# EAGLE design Matchstick 2.0 (EAGLE 9.6.2)
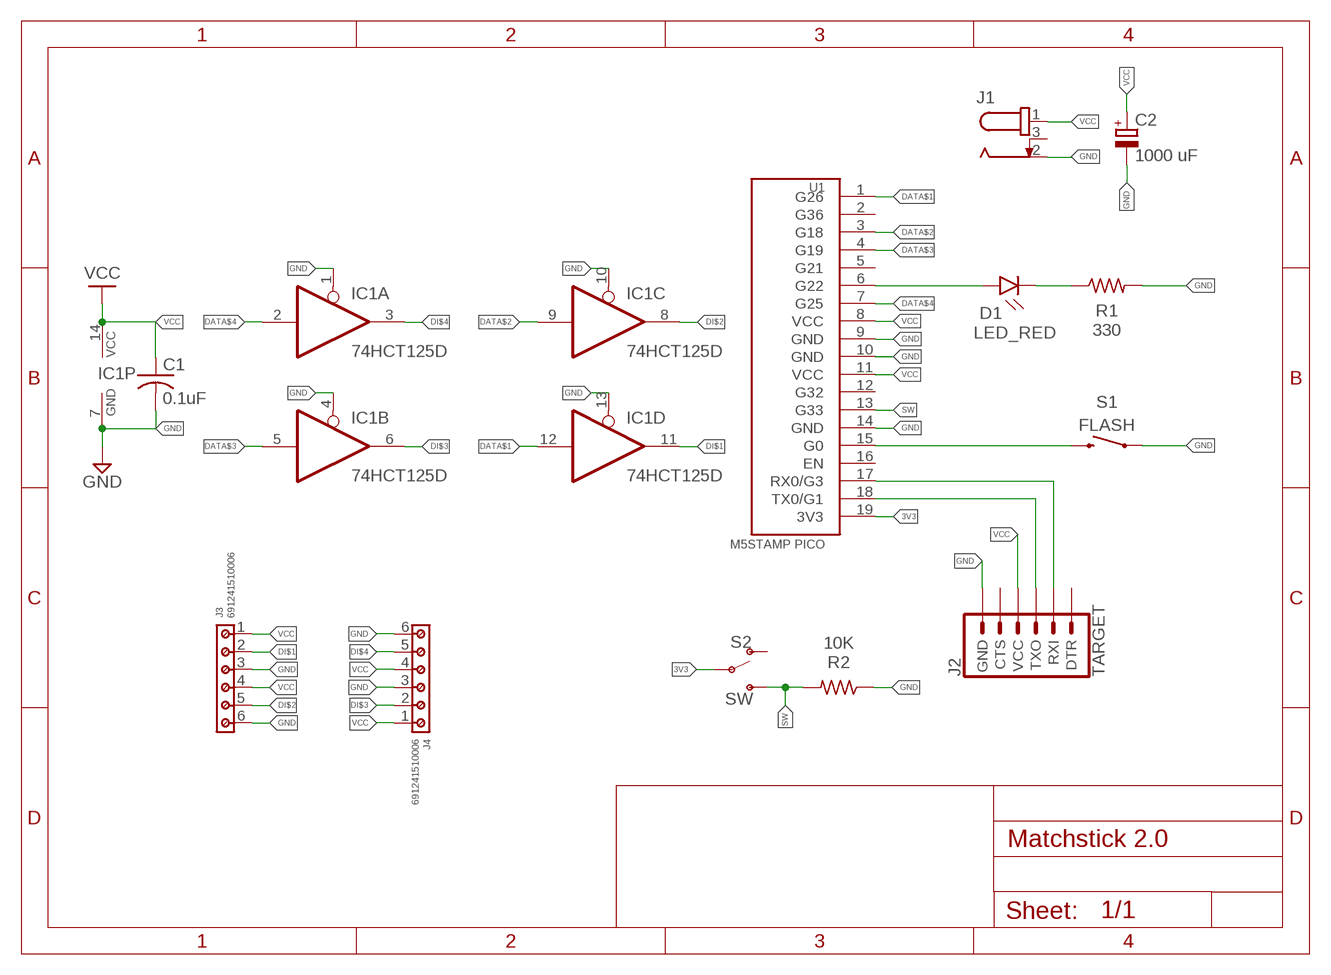
[diagram p0: schematic, sheet 1]

## Parts
C1  0.1uF  C-US_CHIP-0805(2012-METRIC)  [CAPC2012X110]
C2  1000 uF  C-POL_RADIAL-11MM-DIA  [CAPPRD508W65D1000H1100B]
D1  LED_RED  CHIP-FLAT-R_0805  [LEDC2012X110N_FLAT-R]
IC1  74HCT125D  [SO14]
J1  694106301002  [694106301002]
J2  TARGET  6_PIN_SERIAL_TARGETSILK  [6_PIN_SERIAL_TARGET_SIDE_W_SILK]
J3  691241510006  [691241510006]
J4  691241510006  [691241510006]
R1  330  R-US_CHIP-0805(2012-METRIC)  [RESC2012X65]
R2  10K  R-US_CHIP-0805(2012-METRIC)  [RESC2012X65]
S1  FLASH  MOMENTARY-SWITCH-SPST-SMD-5.2MM  [TACTILE_SWITCH_SMD_5.2MM]
S2  SW  SWITCH-SPDT-SMD-RIGHT-ANGLE  [SWITCH_SPST_SMD_A]
U1  M5STAMP PICO  M5STAMP-PICO  [M5STAMP-PICO]

## Nets
3V3: S2.2(P) U1.19(3V3)
DATA$1: IC1.12(D:I) U1.1(G26)
DATA$2: IC1.9(C:I) U1.3(G18)
DATA$3: IC1.5(B:I) U1.4(G19)
DATA$4: IC1.2(A:I) U1.7(G25)
DI$1: IC1.11(D:O) J3.2
DI$2: IC1.8(C:O) J3.5
DI$3: IC1.6(B:O) J4.2
DI$4: IC1.3(A:O) J4.5
G0: S1.3 U1.15(G0)
GND: C1.2 C2.2(-) IC1.1(A:OE) IC1.4(B:OE) IC1.7(P:GND) IC1.10(C:OE) IC1.13(D:OE) J1.2 J2.P$6(GND) J3.3 J3.6 J4.3 J4.6 R1.2 R2.1 S1.1 U1.9(GND) U1.10(GND) U1.14(GND)
RX: J2.P$3(RXI) U1.17(RX0/G3)
SATUS_LED$1: D1.A U1.6(G22)
SATUS_LED$2: D1.C R1.1
SW: R2.2 S2.3(S) U1.13(G33)
TX: J2.P$2(TXO) U1.18(TX0/G1)
VCC: C1.1 C2.1(+) IC1.14(P:VCC) J1.1 J2.P$4(VCC) J3.1 J3.4 J4.1 J4.4 U1.8(VCC) U1.11(VCC)
Unconnected: J1.3 J2.P$1(DTR) J2.P$5(CTS) S2.1(O) U1.2(G36) U1.5(G21) U1.12(G32) U1.16(EN)

## Library data of the parts
C1 = Capacitor:C-US: Capacitor - ANSI; CATEGORY: Capacitor
C2 = Capacitor:C-POL: Capacitor Polarised - Generic; CATEGORY: Capacitor
D1 = LED:CHIP-FLAT-R; CATEGORY: LED; COLOR: RED; DESCRIPTION: CHIP LED FLAT; SUB-CATEGORY: CHIP; TYPE: FLAT_TOP
IC1 = 74xx-eu:74*125: Quad bus BUFFER, 3-state
J1 = DC Power Jacks:694106301002: CONN PWR JACK 2.1X5.5MM SOLDER Manufacturer's datasheet <https://katalog.we-online.de/em/datasheet/6941xx301002.pdf>; CREATED_BY: PCBLayout.com; DIGIKEY_PART_NUMBER: 732-5930-ND; MANUFACTURER: Wurth Electronics Inc.; MPN: 694106301002
J2 = custom:6_PIN_SERIAL_TARGET: 6-pin header connection for use with the "FTDI BASIC" pinout - TARGET SIDE. Also known as "Arduino Serial Program Header". It is used to mate with our FTDI Basic serial programmers using the Arduino IDE. Note, this device has "TARGET" in the name. It is intended to be used on a design that contains a target micro-controller that you wish to program. The "sister" device, named "CABLE" is inteneded to be used on a design that usually lives on the end of your USB cable and prvides the converter chip (FTDI232 or FTDI231x) to commnicate serial RX/TX. You can populate with some of these: Break Away Headers - Straight <https://www.sparkfun.com/products/116> (PRT-00116) For reference (or to suit your programming needs) check out these designs: SparkFun FTDI Basic Breakout - 5V <https://www.sparkfun.com/products/9716> (DEV-09716) SparkFun FTDI Basic Breakout - 3.3V <https://www.sparkfun.com/products/9873> (DEV-09873) SparkFun FTDI SmartBasic <https://www.sparkfun.com/products/12935> (DEV-12935) SparkFun Beefy 3 - FTDI Basic Breakout <https://www.sparkfun.com/products/13746> (DEV-13746)
J3 J4 = Wurth_Connectors_WR-TBL Rising Cage Clamp:691241510006: WR-TBL Serie 2415 - 5.08 mm Horizontal Entry Modular w. Rising Cage Clamp KIND PROPERTIES Pitch 5.08 mm MATERIAL PROPERTIES Insulator Material PA66 Insulator Flammability Rating UL94 V-0 Terminal Screw Material Steel Terminal Screw Plating Zinc Wire Guard Material Copper Alloy GENERAL INFORMATION Operating Temperature -30 up to +120 °C Compliance ROHS & Reach ELECTRICAL PROPERTIES IR UL 14 A IR VDE 24 A Working Voltage [UL] 300 V (AC) Working Voltage [VDE] 250 V (AC) Withstanding Voltage [UL] 1600 V (AC) Withstanding Voltage [VDE] 2000 V (AC) Contact Resistance 20 mΩ MECHANICAL PROPERTIES Wire Strip Length 6 Screw M3 CERTIFICATION UL Approval E150931 VDE Approval 40021365 PACKAGING PROPERTIES Packaging Box <https://www.we-online.com/catalog/media/o79416v209%20Family_WR-TBL_6912427000xx_6912425000xx.jpg> Details see: https://www.we-online.com/catalog/en/TBL_5_08_2415_HORIZONTAL_ENTRY_W_RISING_CAGE_6912415100xx/ Updated by Ella Wu 2019-11-26 2019(C) Wurth Elektronik; IR-UL: 14A; IR-VDE: 14A; PART-NUMBER: 691241510006; PINS: 6; PITCH: 5.08mm; TYPE: Horizontal; WIRE: 14 to 30 (AWG) 2.08 to 0.0509 (mm²); WORKING-VOLTAGE-UL: 300V (AC); WORKING-VOLTAGE-VDE: 250V (AC)
R1 R2 = Resistor:R-US: Resistor Fixed - ANSI; CATEGORY: Resistor; SUB-CATEGORY: Fixed
S1 = SparkFun-Switches:MOMENTARY-SWITCH-SPST: Momentary Switch (Pushbutton) - SPST Normally-open (NO) SPST momentary switches (buttons, pushbuttons). Variants PTH-12MM - 12mm square, through-hole Momentary Pushbutton Switch - 12mm Square <https://www.sparkfun.com/products/9190> (COM-09190) PTH-6.0MM, PTH-6.0MM-KIT - 6.0mm square, through-hole Mini Pushbutton Switch <https://www.sparkfun.com/products/97> (COM-00097) KIT package intended for soldering kit's - only one side of pads' copper is exposed. PTH-RIGHT-ANGLE-KIT - Right-angle, through-hole Right Angle Tactile Button <https://www.sparkfun.com/products/10791> - Used on SparkFun BigTime Watch Kit <https://www.sparkfun.com/products/11734> SMD-12MM - 12mm square, surface-mount Tactile Button - SMD (12mm) <https://www.sparkfun.com/products/12993> (COM-12993) Used on SparkFun PicoBoard <https://www.sparkfun.com/products/11888> SMD-4.5MM - 4.5mm Square Trackball Switch Used on SparkFun Blackberry Trackballer Breakout <https://www.sparkfun.com/products/13169> SMD-4.6MMX2.8MM - 4.60mm x 2.80mm, surface mount Used on SparkFun SAMD21 Mini Breakout <https://www.sparkfun.com/products/13664> SMD-5.2MM, SMD-5.2-REDUNDANT - 5.2mm square, surface-mount Mini Pushbutton Switch - SMD <https://www.sparkfun.com/products/8720> (COM-08720) Used on Arduino Pro Mini <https://www.sparkfun.com/products/11114> REDUNDANT package connects both switch circuits together SMD-6.0X3.5MM - 6.0 x 3.5mm, surface mount Momentary Reset Switch SMD <https://www.sparkfun.com/products/8229> (COM-08229) SMD-6.2MM-TALL - 6.2mm square, surface mount Tactile Button - SMD (6mm) <https://www.sparkfun.com/products/12992> Used on SparkFun Digital Sandbox <https://www.sparkfun.com/products/12651> SMD-RIGHT-ANGLE - Right-angle, surface mount Used on SparkFun Block for Intel® Edison - Arduino <https://www.sparkfun.com/products/13036>; PROD_ID: SWCH-08247; SF_SKU: COM-08720
S2 = SparkFun-Switches:SWITCH-SPDT: Single Pole, Double Throw (SPDT) Switch Single-pole, double-throw (SPDT) switch. Variant Overview SMD-AYZ0202 Surface Mount DPDT Switch <https://www.sparkfun.com/products/597> (COM-00597) Used on e.g. LilyPad Arduino USB - ATmega32U4 Board <https://www.sparkfun.com/products/12049> PTH-11.6X4.0MM SPDT Mini Power Switch <https://www.sparkfun.com/products/102> (COM-00102) Used on e.g. SparkFun Simon Says - Through-Hole Soldering Kit <https://www.sparkfun.com/products/10547> (KIT-10547) PTH-11.6X4.0MM-KIT KIT version of SPDT Mini Power Switch - Simplifies soldering by removing tStop of switch pins - only one side can be soldered. PTH-11.6X4.0MM-LOCK LOCK version of SPDT Mini Power Switch - Offset pins hold switch in place for easier soldering. SMD-RIGHT-ANGLE Surface Mount Right Angle Switch <https://www.sparkfun.com/products/10860> (COM-10860) Used on e.g. SparkFun ESP8266 Thing <https://www.sparkfun.com/products/13231>; PROD_ID: SWCH-10651; SF_SKU: COM-10860
U1 = custom:M5STAMP-PICO: M5 Stamp Pico <https://docs.m5stack.com/en/core/stamp_pico>

## Board
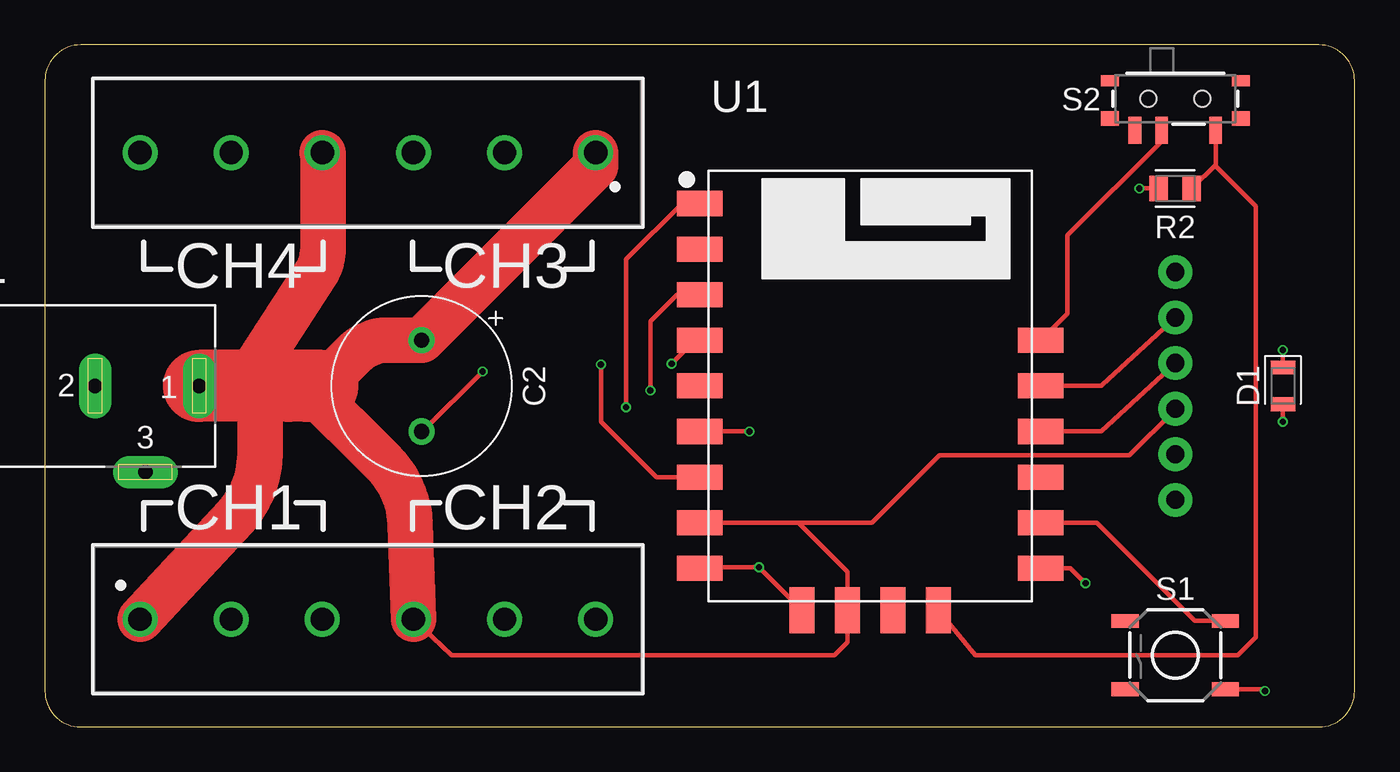
[diagram p1: board, top side]
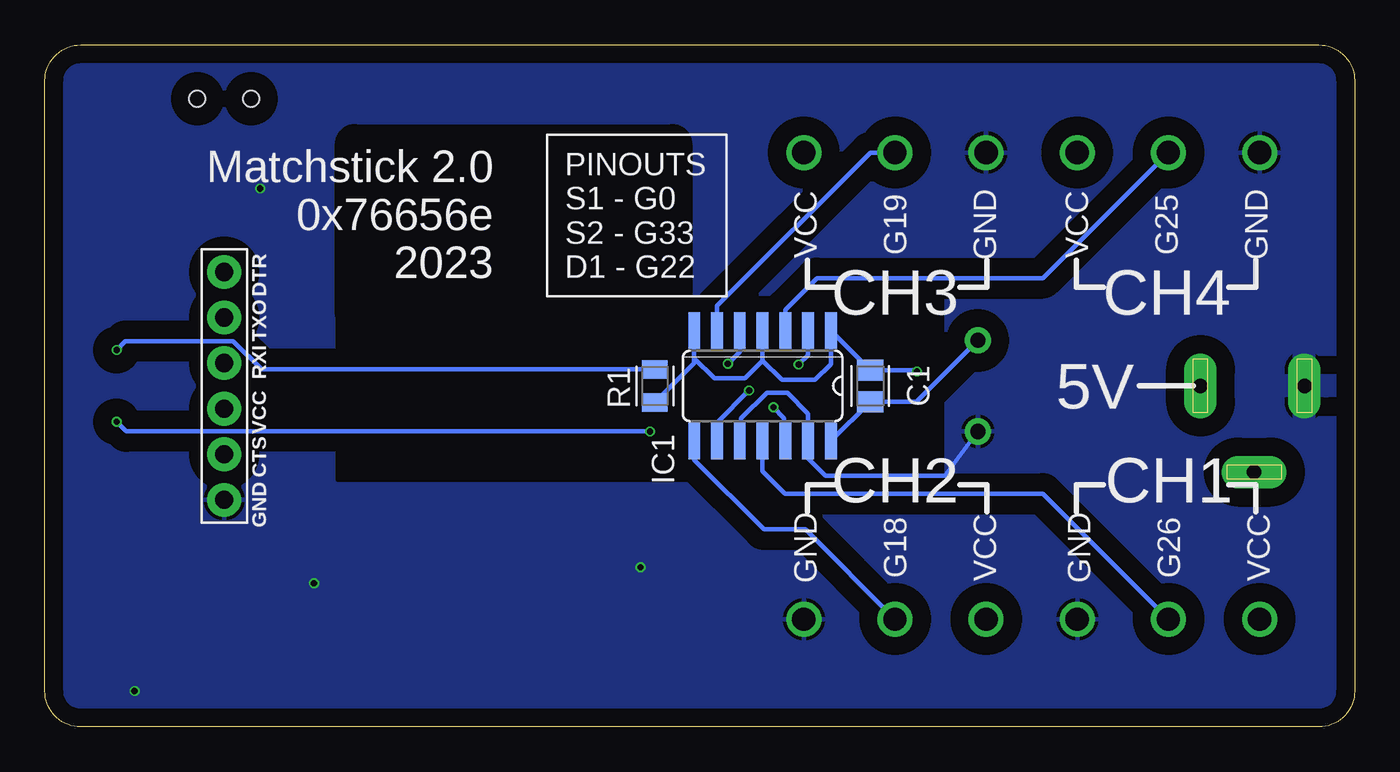
[diagram p2: board, bottom side, seen from below]

Size 73 x 38 mm. Coordinates in mm from the lower left corner, seen from the top.
Outline: 0,36 0,2 arc90 2,0 71,0 arc90 73,2 73,36 arc90 71,38 2,38 arc90 0,36
Copper layers (1*16): Top 0.035mm / dielectric 1.5mm / Bottom 0.035mm
Design rules "PCBWay_2L_152um-Track": minimum track width 6mil, minimum drill 0.3mm, track to track 6mil, track to pad 6mil, pad to pad 6mil, via to via 6mil, smd to smd 0mil, copper to edge 0.3mm, drill to drill 10mil, minimum pad ring 6mil, minimum via ring 0.1mm, stop-mask expansion 2mil, vias tented up to drill 0.45mm, thermal gap 0.2mm

### Footprints (pad centres in the part's own frame; a part is rotated, then mirrored left to right if it is on the bottom)
CAPC2012X110 = smd 1.165 x 1.465: 1 -0.875,0; 2 0.875,0
CAPPRD508W65D1000H1100B = drill 0.85 pad 1.45: 1 -2.54,0; 2 2.54,0
LEDC2012X110N_FLAT-R = smd 0.762 x 1.362: A 1.025,0; C -1.025,0
SO14 = smd 0.66 x 2.032: 1 -3.81,-3.073; 2 -2.54,-3.073; 3 -1.27,-3.073; 4 0,-3.073; 5 1.27,-3.073; 6 2.54,-3.073; 7 3.81,-3.073; 8 3.81,3.073; 9 2.54,3.073; 10 1.27,3.073; 11 0,3.073; 12 -1.27,3.073; 13 -2.54,3.073; 14 -3.81,3.073
694106301002 = drill 0.8 pad 1.8 long: 1 13.6,0; 2 7.8,0; 3 10.6,-4.8
6_PIN_SERIAL_TARGET_SIDE_W_SILK = drill 1.016 pad 1.88: P$1 -6.35,0; P$2 -3.81,0; P$3 -1.27,0; P$4 1.27,0; P$5 3.81,0; P$6 6.35,0
691241510006 = drill 1.3: 1 -12.7,0; 2 -7.62,0; 3 -2.54,0; 4 2.54,0; 5 7.62,0; 6 12.7,0
RESC2012X65 = smd 1.031 x 1.42: 1 -0.919,0; 2 0.919,0
TACTILE_SWITCH_SMD_5.2MM = smd 1.524 x 0.762: 1 -2.794,1.905; 2 2.794,1.905; 3 -2.794,-1.905; 4 2.794,-1.905
SWITCH_SPST_SMD_A = smd 0.7 x 1.5: 1 -2.25,-1.75; 2 -0.75,-1.75; 3 2.25,-1.75 | smd 1 x 0.6: GND1 -3.65,1; GND3 3.65,1 | smd 1 x 0.8: GND2 -3.65,-1.1; GND4 3.65,-1.1 | hole 0.9: -1.5,0; 1.5,0
M5STAMP-PICO = smd 2.54 x 1.4: 1 -9.5,10.16; 2 -9.5,7.62; 3 -9.5,5.08; 4 -9.5,2.54; 5 -9.5,0; 6 -9.5,-2.54; 7 -9.5,-5.08; 8 -9.5,-7.62; 9 -9.5,-10.16; 14 9.5,-10.16; 15 9.5,-7.62; 16 9.5,-5.08; 17 9.5,-2.54; 18 9.5,0; 19 9.5,2.54 | smd 1.4 x 2.54: 10 -3.81,-12.5; 11 -1.27,-12.5; 12 1.27,-12.5; 13 3.81,-12.5

### Placement (x,y rotation side)
C1  27,19 90 bottom
C2  21,19 270 top
D1  69,19 270 top
IC1  33,19 180 bottom
J1  -5,19 0 top
J2  63,19 270 bottom
J3  18,6 0 top
J4  18,32 180 top
R1  39,19 270 bottom
R2  63,30 0 top
S1  63,4 180 top
S2  63,35 0 top
U1  46,19 0 top

### Tracks (layer width: path | path; a pad name or v marks a point on that pad's centre or on a via)
3V3
  Top 0.254: S2.2 62.25,32.63 57,27.38 57,23.03 U1.19
  Top 0.508: U1.19
DATA$1  (via drill 0.35)
  Top 0.254: v32.4,17.81 32.4,26.05 35.51,29.16 U1.1
  Bottom 0.254: v32.4,17.81 31.79,17.21 31.79,15.99 IC1.12
DATA$2  (via drill 0.35)
  Top 0.254: v33.75,18.75 33.75,22.6 35.23,24.08 U1.3
  Bottom 0.254: v33.75,18.75 35.54,16.95 IC1.9
DATA$3  (via drill 0.35)
  Top 0.254: v34.94,20.24 36.24,21.54
  Top 0.508: 36.24,21.54 U1.4
  Bottom 0.254: v34.94,20.24 34.27,20.9 IC1.5
DATA$4  (via drill 0.35)
  Top 0.254: U1.7 34.08,13.92 31,17 v31,20.18
  Top 0.508: v30.99,20.19 v31,20.18
  Bottom 0.254: v30.99,20.19 30.46,20.72 IC1.2
DI$1
  Bottom 0.254: J3.2 17.38,13 31.75,13 33,14.26 IC1.11
DI$2
  Bottom 0.254: J3.5 30.62,11 32.93,11 36.81,14.88 IC1.8
DI$3
  Bottom 0.254: J4.2 27,32 35.54,23.46 IC1.6
DI$4
  Bottom 0.254: J4.5 17.38,25 29.97,25 31.73,23.24 IC1.3
G0
  Top 0.254: S1.3 64.09,5.91 58.62,11.38 U1.15
GND  (via drill 0.35)
  Top 0.254: S1.1 67.91,2.1 v68,2 | R2.1 v61,30 | U1.10 v39.8,8.89 v39.8,8.9 36.56,8.9 U1.9 | U1.14 57.16,8.84 v58,8 | C2.2 21.06,16.46 v24.4,19.8
  Bottom 0.254: C2.2 22.83,14 29.49,14 30.46,14.97 IC1.13 30.46,17.46 31.62,18.62 32.76,18.62 34.19,17.19 34.19,16.01 IC1.10 | 33,20.4 31.93,19.33 30.07,19.33 29.19,20.21 IC1.1 C1.2 24.48,19.88 v24.4,19.8 | 36.81,20.55 35.68,19.42 33.98,19.42 33,20.4 | 33,20.4 IC1.4 | 36.81,20.55 IC1.7 | R1.2 36.81,20.27 36.81,20.55
  pour Bottom (isolate 1.016): 0,0 73,0 73,38 0,38 0,24 5,24 5,14 0,14
  pour Bottom (isolate 1.016): 0,24 5,24 5,14 0,14
  cutout Bottom: 23,23.89 56.69,23.89 56.69,13.78 23,13.78
RX
  Top 0.254: J2.P$3 59.21,16.77 58.9,16.46 U1.17
SATUS_LED$1  (via drill 0.35)
  Top 0.254: D1.A v69,17 | v39.27,16.46 U1.6
  Bottom 0.254: v69,17 68.46,16.46 v39.27,16.46
SATUS_LED$2  (via drill 0.35)
  Top 0.254: v69,21 D1.C
  Bottom 0.254: R1.1 60.92,19.92 62.49,21.49 68.51,21.49 v69,21
SW
  Top 0.254: U1.13 51.86,4 66.5,4 67.5,5 67.5,29 65.25,31.25 S2.3 65.25,31.33 R2.2
TX
  Top 0.254: J2.P$2 58.94,19.07 58.88,19 U1.18
VCC
  Top 0.254: 62.98,17.66 60.45,15.12 49.85,15.12 46.11,11.38 42,11.38 | J3.4 22.67,4 44,4 44.73,4.73 U1.11 44.73,8.65 42,11.38 | U1.8 42,11.38
  Top 0.508: J2.P$4 62.98,17.66
  Top 2.54: J3.4 20.37,11.28 arc43 18.87,14.72 14.57,19 | J4.4 15.5,31.96 15.5,26.6 arc-33 15.1,25.24 11.06,19 | J3.1 10.6,11.69 arc43 12,15.25 12,19 13.57,19 | J4.1 30.7,31.24 C2.1 19.04,21.54 arc45 17.27,20.81 15.46,19
  Top 4: 15.46,19 14.57,19 13.57,19 | 12,19 11.06,19 J1.1
  Bottom 0.254: C2.1 24.41,18.12 C1.1 IC1.14
  Bottom 0.508: IC1.14

### Text on the board
tPlace: CH4 | CH3 | CH1 | CH2
bPlace: GND | G25 | VCC | GND | G19 | VCC | CH4 | CH3 | PINOUTS / S1 - G0 / S2 - G33 / D1 - G22 | Matchstick 2.0 / 0x76656e / 2023 | 5V | CH1 | CH2 | VCC | G26 | GND | VCC | G18 | GND